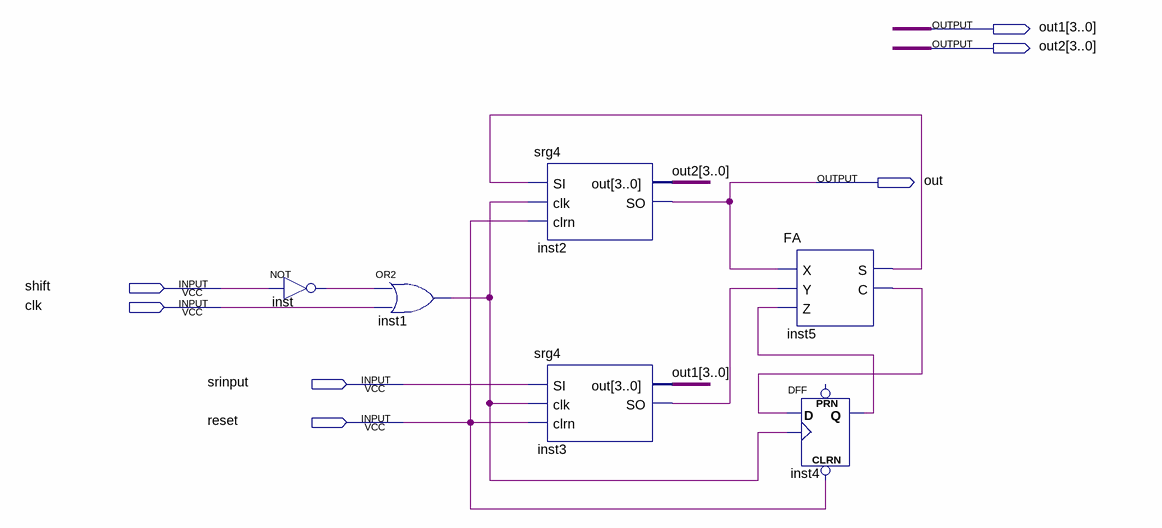
[diagram p0: schematic sheet]
// Quartus schematic ep3_2_1.bdf as structural Verilog: 6 symbols, 7 pins
module ep3_2_1 (
  input  shift,
  input  clk,
  input  srinput,
  input  reset,
  output [3:0] out1,
  output [3:0] out2,
  output out
);

  wire inst1_out, inst3_so, inst4_q, inst5_c, inst5_s, inst_out;

  not inst (inst_out, shift);
  or inst1 (inst1_out, inst_out, clk);
  srg4 inst2 (.SI(inst5_s), .clk(inst1_out), .clrn(reset), .out(out2), .SO(out));
  srg4 inst3 (.SI(srinput), .clk(inst1_out), .clrn(reset), .out(out1), .SO(inst3_so));
  FA inst5 (.X(out), .Y(inst3_so), .Z(inst4_q), .S(inst5_s), .C(inst5_c));
  DFF inst4 (.CLRN(reset), .CLK(inst1_out), .D(inst5_c), .Q(inst4_q));  // open: PRN
endmodule
